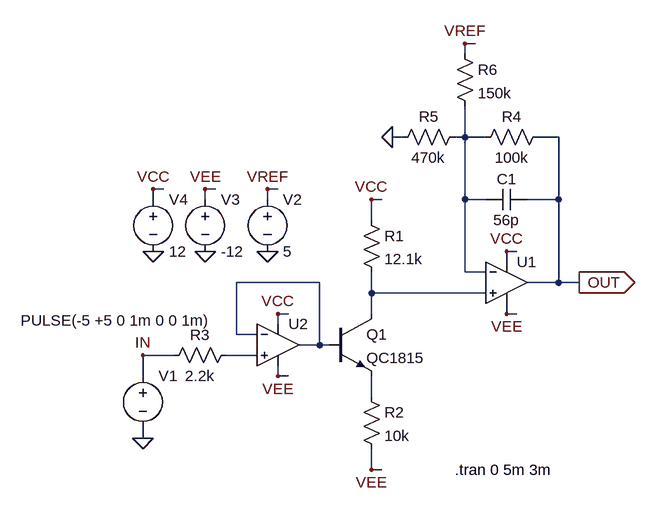
[diagram p0: schematic SAW_TRI_A2+Amp_PreBuffer .asc]
SAW_TRI_A2+Amp_PreBuffer .asc, the LTspice schematic file:
Version 4
SHEET 1 956 680
WIRE 400 -288 384 -288
WIRE 384 -272 384 -288
WIRE 288 -144 272 -144
WIRE 384 -144 384 -192
WIRE 384 -144 368 -144
WIRE 416 -144 384 -144
WIRE 528 -144 496 -144
WIRE -80 -64 -96 -64
WIRE 0 -64 -16 -64
WIRE 96 -64 80 -64
WIRE -96 -48 -96 -64
WIRE -16 -48 -16 -64
WIRE 80 -48 80 -64
WIRE 256 -48 240 -48
WIRE 384 -48 384 -144
WIRE 416 -48 384 -48
WIRE 528 -48 528 -144
WIRE 528 -48 480 -48
WIRE 240 -16 240 -48
WIRE 464 32 448 32
WIRE 448 48 448 32
WIRE 384 64 384 -48
WIRE 416 64 384 64
WIRE 160 80 32 80
WIRE 528 80 528 -48
WIRE 528 80 480 80
WIRE 560 80 528 80
WIRE 240 96 240 64
WIRE 416 96 240 96
WIRE 112 128 96 128
WIRE 240 128 240 96
WIRE 448 128 448 112
WIRE 464 128 448 128
WIRE 96 144 96 128
WIRE 32 160 32 80
WIRE 64 160 32 160
WIRE 160 176 160 80
WIRE 160 176 128 176
WIRE 176 176 160 176
WIRE -64 192 -112 192
WIRE 64 192 16 192
WIRE -112 224 -112 192
WIRE 96 224 96 208
WIRE 112 224 96 224
WIRE 240 256 240 224
WIRE -112 320 -112 304
WIRE 240 368 240 336
WIRE 256 368 240 368
FLAG -112 320 0
FLAG -112 192 IN
FLAG 240 -48 VCC
FLAG 240 368 VEE
FLAG 560 80 OUT
IOPIN 560 80 Out
FLAG -16 32 0
FLAG -96 32 0
FLAG -16 -64 VEE
FLAG -96 -64 VCC
FLAG 448 32 VCC
FLAG 448 128 VEE
FLAG 272 -144 0
FLAG 384 -288 VREF
FLAG 80 32 0
FLAG 80 -64 VREF
FLAG 96 128 VCC
FLAG 96 224 VEE
SYMBOL npn 176 128 R0
SYMATTR InstName Q1
SYMATTR Value QC1815
SYMBOL voltage -112 208 R0
WINDOW 3 -188 -70 Left 2
WINDOW 123 0 0 Left 2
WINDOW 39 0 0 Left 2
SYMATTR Value PULSE(-5 +5 0 1m 0 0 1m)
SYMATTR InstName V1
SYMBOL res 224 -32 R0
SYMATTR InstName R1
SYMATTR Value 12.1k
SYMBOL res 224 240 R0
SYMATTR InstName R2
SYMATTR Value 10k
SYMBOL voltage -16 -64 R0
WINDOW 123 0 0 Left 2
WINDOW 39 0 0 Left 2
SYMATTR InstName V3
SYMATTR Value -12
SYMBOL voltage -96 -64 R0
WINDOW 123 0 0 Left 2
WINDOW 39 0 0 Left 2
SYMATTR InstName V4
SYMATTR Value 12
SYMBOL Opamps\\UniversalOpamp2 448 80 R0
SYMATTR InstName U1
SYMBOL cap 480 -64 R90
WINDOW 0 0 32 VBottom 2
WINDOW 3 32 32 VTop 2
SYMATTR InstName C1
SYMATTR Value 56p
SYMBOL res 512 -160 R90
WINDOW 0 0 56 VBottom 2
WINDOW 3 32 56 VTop 2
SYMATTR InstName R4
SYMATTR Value 100k
SYMBOL res 384 -160 R90
WINDOW 0 0 56 VBottom 2
WINDOW 3 32 56 VTop 2
SYMATTR InstName R5
SYMATTR Value 470k
SYMBOL res 368 -288 R0
SYMATTR InstName R6
SYMATTR Value 150k
SYMBOL voltage 80 -64 R0
WINDOW 123 0 0 Left 0
WINDOW 39 0 0 Left 0
SYMATTR InstName V2
SYMATTR Value 5
SYMBOL Opamps\\UniversalOpamp2 96 176 R0
SYMATTR InstName U2
SYMBOL res 32 176 R90
WINDOW 0 0 56 VBottom 2
WINDOW 3 32 56 VTop 2
SYMATTR InstName R3
SYMATTR Value 2.2k
TEXT 368 368 Left 2 !.tran 0 5m 3m

The netlist it stands for:
* SAW_TRI_A2+Amp_PreBuffer .asc
Q1 N003 N002 N005 0 QC1815
V1 IN 0 PULSE(-5 +5 0 1m 0 0 1m)
R1 VCC N003 12.1k
R2 N005 VEE 10k
V3 VEE 0 -12
V4 VCC 0 12
XU1 N003 N001 VCC VEE OUT level.2 Avol=1Meg GBW=10Meg Slew=10Meg ilimit=25m rail=0 Vos=0 phimargin=45 en=0 enk=0 in=0 ink=0 Rin=500Meg  ; pins IN+ IN- V+ V- OUT
C1 OUT N001 56p
R4 OUT N001 100k
R5 N001 0 470k
R6 VREF N001 150k
V2 VREF 0 5
XU2 N004 N002 VCC VEE N002 level.2 Avol=1Meg GBW=10Meg Slew=10Meg ilimit=25m rail=0 Vos=0 phimargin=45 en=0 enk=0 in=0 ink=0 Rin=500Meg  ; pins IN+ IN- V+ V- OUT
R3 N004 IN 2.2k
.model NPN NPN
.model PNP PNP
.lib standard.bjt
.tran 0 5m 3m
.lib UniversalOpamps2.sub
.backanno
.end